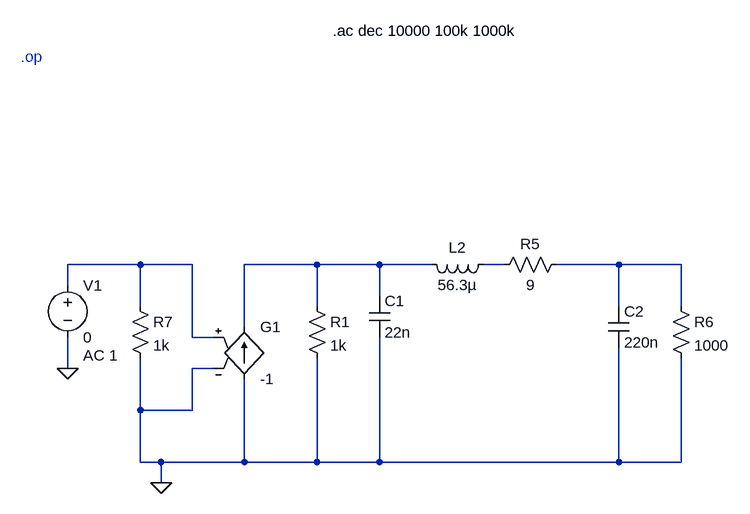
[diagram p0: schematic labosc3.asc]
labosc3.asc, the LTspice schematic file:
Version 4
SHEET 1 1188 680
WIRE 80 96 -32 96
WIRE 160 96 80 96
WIRE 352 96 240 96
WIRE 448 96 352 96
WIRE 528 96 448 96
WIRE 640 96 608 96
WIRE 816 96 720 96
WIRE 912 96 816 96
WIRE -32 128 -32 96
WIRE 448 144 448 96
WIRE 80 160 80 96
WIRE 352 160 352 96
WIRE 816 160 816 96
WIRE 912 160 912 96
WIRE 240 192 240 96
WIRE 160 208 160 96
WIRE 192 208 160 208
WIRE -32 256 -32 208
WIRE 192 256 160 256
WIRE 80 320 80 240
WIRE 160 320 160 256
WIRE 160 320 80 320
WIRE 80 400 80 320
WIRE 112 400 80 400
WIRE 240 400 240 272
WIRE 240 400 112 400
WIRE 352 400 352 240
WIRE 352 400 240 400
WIRE 448 400 448 208
WIRE 448 400 352 400
WIRE 816 400 816 224
WIRE 816 400 448 400
WIRE 912 400 912 240
WIRE 912 400 816 400
WIRE 112 432 112 400
FLAG -32 256 0
FLAG 112 432 0
SYMBOL voltage -32 112 R0
WINDOW 123 24 124 Left 2
WINDOW 39 0 0 Left 0
SYMATTR Value2 AC 1
SYMATTR InstName V1
SYMATTR Value 0
SYMBOL cap 432 144 R0
SYMATTR InstName C1
SYMATTR Value 22n
SYMBOL ind 624 80 R90
WINDOW 0 5 56 VBottom 2
WINDOW 3 32 56 VTop 2
SYMATTR InstName L2
SYMATTR Value 56.3µ
SYMBOL cap 800 160 R0
SYMATTR InstName C2
SYMATTR Value 220n
SYMBOL res 736 80 R90
WINDOW 0 0 56 VBottom 2
WINDOW 3 32 56 VTop 2
SYMATTR InstName R5
SYMATTR Value 9
SYMBOL res 336 144 R0
SYMATTR InstName R1
SYMATTR Value 1k
SYMBOL res 896 144 R0
SYMATTR InstName R6
SYMATTR Value 1000
SYMBOL g 240 176 R0
SYMATTR InstName G1
SYMATTR Value -1
SYMBOL res 64 144 R0
SYMATTR InstName R7
SYMATTR Value 1k
TEXT -104 -224 Left 2 ;.op
TEXT 376 -264 Left 2 !.ac dec 10000 100k 1000k

The netlist it stands for:
* labosc3.asc
V1 N001 0 0 AC 1
C1 N002 0 22n
L2 N003 N002 56.3µ
C2 N004 0 220n
R5 N004 N003 9
R1 N002 0 1k
R6 N004 0 1000
G1 0 N002 N001 0 -1
R7 N001 0 1k
* .op
.ac dec 10000 100k 1000k
.backanno
.end